# Altium schematic sheet Sheet1.SchDoc
size A4; SheetNumber: 1; SheetTotal: 2
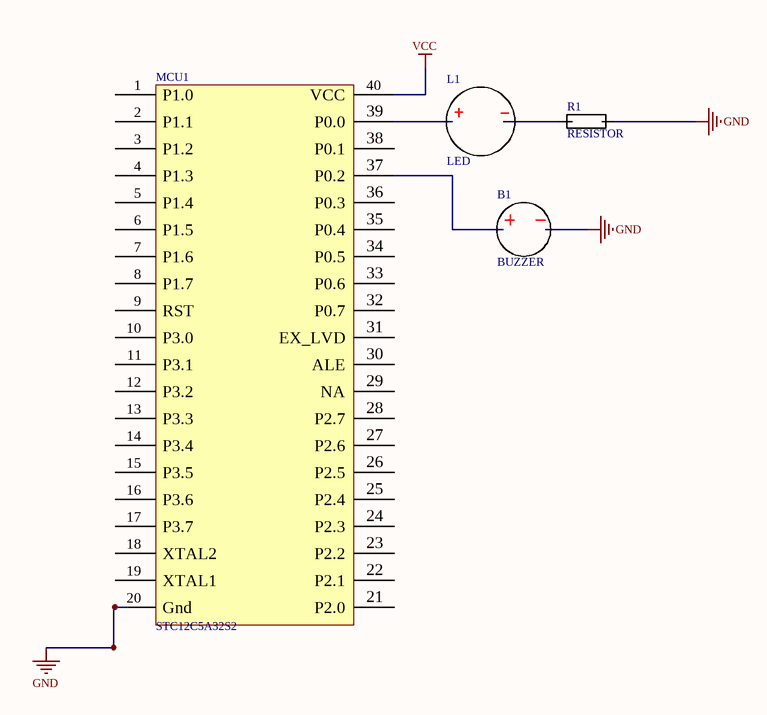
[diagram p0: Sheet1.SchDoc]

## Parts
B1  BUZZER  [BUZZER]
L1  LED  [LED]
MCU1  STC12C5A32S2  [STC_DIP40]
R1  RESISTOR  [RESISTOR]

## Nets
GND: B1.2 MCU1.20(Gnd) R1.2
VCC: MCU1.40(VCC)
NetB1_1: B1.1 MCU1.37(P0.2)
NetL1_1: L1.1 MCU1.39(P0.0)
NetL1_2: L1.2 R1.1

Not connected (* = marked no-connect by the designer): MCU1 1(P1.0) 2(P1.1) 3(P1.2) 4(P1.3) 5(P1.4) 6(P1.5) 7(P1.6) 8(P1.7) 9(RST) 10(P3.0) 11(P3.1) 12(P3.2) 13(P3.3) 14(P3.4) 15(P3.5) 16(P3.6) 17(P3.7) 18(XTAL2) 19(XTAL1) 21(P2.0) 22(P2.1) 23(P2.2) 24(P2.3) 25(P2.4) 26(P2.5) 27(P2.6) 28(P2.7) 29(NA) 30(ALE) 31(EX_LVD) 32(P0.7) 33(P0.6) 34(P0.5) 35(P0.4) 36(P0.3) 38(P0.1)